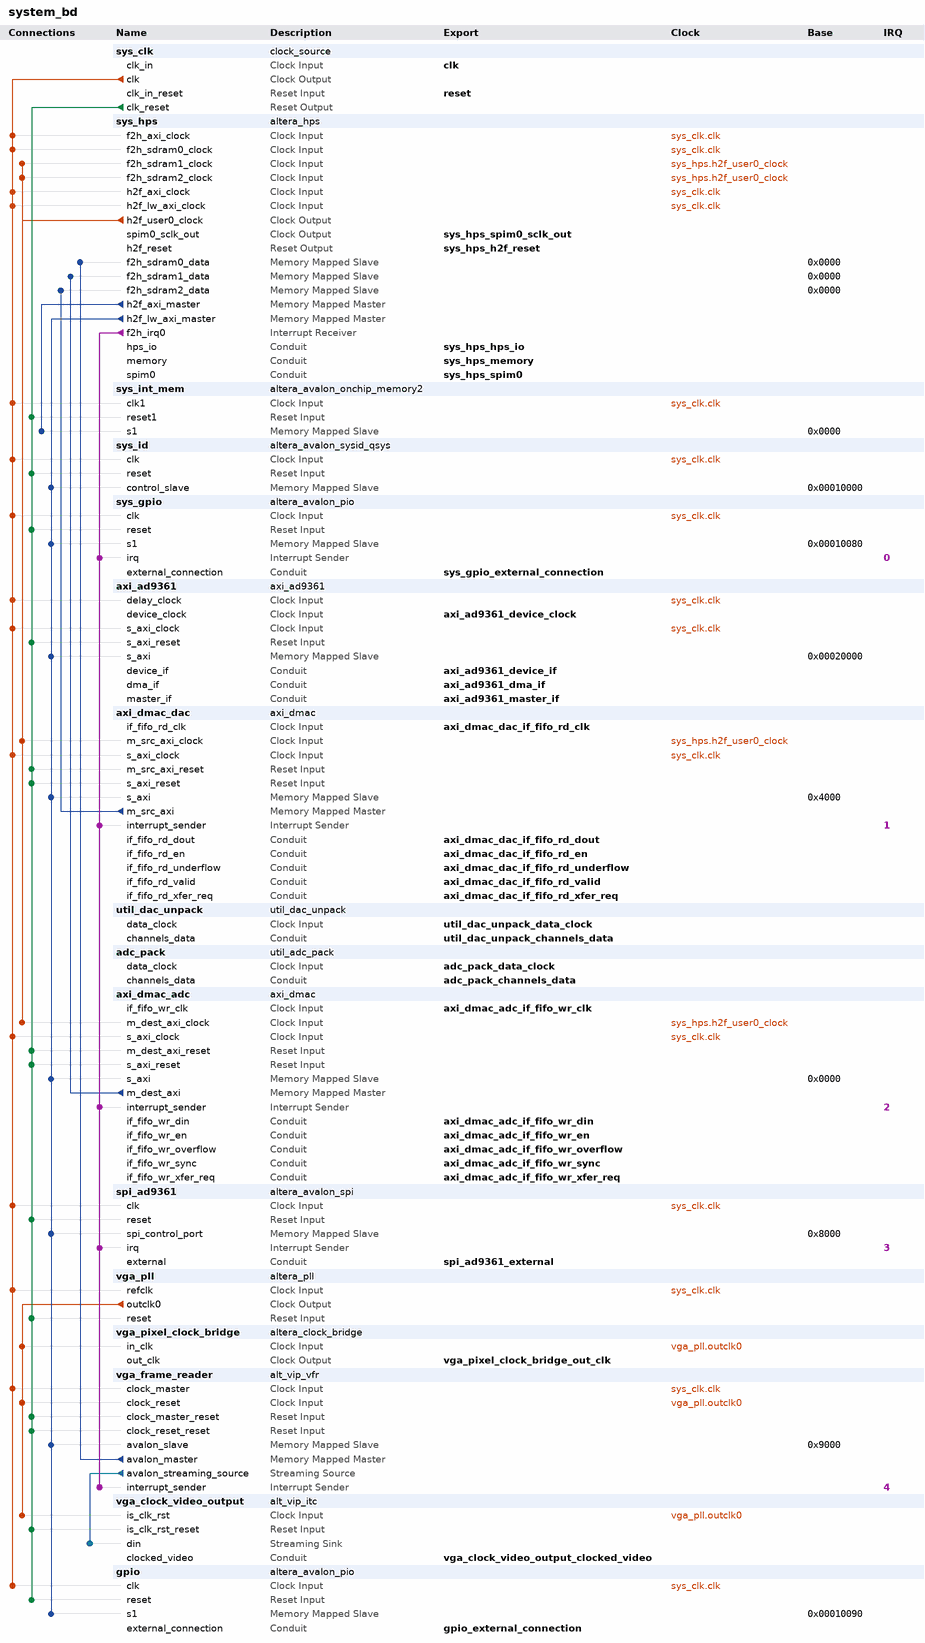
[diagram p0: system contents]
# Platform Designer (Qsys) system system_bd, Cyclone V 5CSXFC6D6F31C8ES
# Parameters at their usual value, and those the tool derives, are not listed.
package require -exact qsys 15.0
create_system system_bd
set_project_property DEVICE_FAMILY {Cyclone V}
set_project_property DEVICE 5CSXFC6D6F31C8ES

add_instance sys_clk clock_source 15.0
set_instance_parameter_value sys_clk clockFrequency 50000000

add_instance sys_hps altera_hps 15.0
set_instance_parameter_value sys_hps EMAC1_Mode RGMII
set_instance_parameter_value sys_hps EMAC1_PinMuxing {HPS I/O Set 0}
set_instance_parameter_value sys_hps F2SCLK_COLDRST_Enable false
set_instance_parameter_value sys_hps F2SCLK_DBGRST_Enable false
set_instance_parameter_value sys_hps F2SCLK_WARMRST_Enable false
set_instance_parameter_value sys_hps F2SDRAM_Type {Avalon-MM Bidirectional,AXI-3,AXI-3}
set_instance_parameter_value sys_hps F2SDRAM_Width 64,64,64
set_instance_parameter_value sys_hps F2SINTERRUPT_Enable true
set_instance_parameter_value sys_hps F2S_Width 2
set_instance_parameter_value sys_hps FPGA_PERIPHERAL_OUTPUT_CLOCK_FREQ_EMAC0_GTX_CLK 100
set_instance_parameter_value sys_hps FPGA_PERIPHERAL_OUTPUT_CLOCK_FREQ_EMAC0_MD_CLK 100.0
set_instance_parameter_value sys_hps FPGA_PERIPHERAL_OUTPUT_CLOCK_FREQ_EMAC1_GTX_CLK 100
set_instance_parameter_value sys_hps FPGA_PERIPHERAL_OUTPUT_CLOCK_FREQ_EMAC1_MD_CLK 100.0
set_instance_parameter_value sys_hps HPS_PROTOCOL DDR3
set_instance_parameter_value sys_hps I2C0_Mode N/A
set_instance_parameter_value sys_hps I2C0_PinMuxing Unused
set_instance_parameter_value sys_hps I2C1_Mode N/A
set_instance_parameter_value sys_hps I2C1_PinMuxing Unused
set_instance_parameter_value sys_hps LWH2F_Enable true
set_instance_parameter_value sys_hps MEM_BANKADDR_WIDTH 3
set_instance_parameter_value sys_hps MEM_CLK_FREQ 400.0
set_instance_parameter_value sys_hps MEM_COL_ADDR_WIDTH 10
set_instance_parameter_value sys_hps MEM_DQ_WIDTH 32
set_instance_parameter_value sys_hps MEM_DRV_STR RZQ/7
set_instance_parameter_value sys_hps MEM_ROW_ADDR_WIDTH 15
set_instance_parameter_value sys_hps MEM_RTT_NOM RZQ/4
set_instance_parameter_value sys_hps MEM_RTT_WR RZQ/4
set_instance_parameter_value sys_hps MEM_TCL 11
set_instance_parameter_value sys_hps MEM_TFAW_NS 30.0
set_instance_parameter_value sys_hps MEM_TRAS_NS 35.0
set_instance_parameter_value sys_hps MEM_TRCD_NS 13.75
set_instance_parameter_value sys_hps MEM_TRFC_NS 260.0
set_instance_parameter_value sys_hps MEM_TRP_NS 13.75
set_instance_parameter_value sys_hps MEM_VENDOR JEDEC
set_instance_parameter_value sys_hps MEM_WTCL 8
set_instance_parameter_value sys_hps QSPI_Mode {1 SS}
set_instance_parameter_value sys_hps QSPI_PinMuxing {HPS I/O Set 0}
set_instance_parameter_value sys_hps REF_CLK_FREQ 25.0
set_instance_parameter_value sys_hps S2FCLK_USER0CLK_Enable true
set_instance_parameter_value sys_hps S2F_Width 2
set_instance_parameter_value sys_hps SDIO_Mode {4-bit Data}
set_instance_parameter_value sys_hps SDIO_PinMuxing {HPS I/O Set 0}
set_instance_parameter_value sys_hps SPIM0_Mode Full
set_instance_parameter_value sys_hps SPIM0_PinMuxing FPGA
set_instance_parameter_value sys_hps SPIM1_Mode {Single Slave Select}
set_instance_parameter_value sys_hps SPIM1_PinMuxing {HPS I/O Set 0}
set_instance_parameter_value sys_hps STM_Enable false
set_instance_parameter_value sys_hps TIMING_BOARD_AC_SKEW 0.03
set_instance_parameter_value sys_hps TIMING_BOARD_AC_TO_CK_SKEW 0.0
set_instance_parameter_value sys_hps TIMING_BOARD_DQ_TO_DQS_SKEW 0.0
set_instance_parameter_value sys_hps TIMING_BOARD_MAX_CK_DELAY 0.03
set_instance_parameter_value sys_hps TIMING_BOARD_MAX_DQS_DELAY 0.02
set_instance_parameter_value sys_hps TIMING_BOARD_SKEW_BETWEEN_DQS 0.08
set_instance_parameter_value sys_hps TIMING_BOARD_SKEW_CKDQS_DIMM_MAX 0.16
set_instance_parameter_value sys_hps TIMING_BOARD_SKEW_CKDQS_DIMM_MIN 0.09
set_instance_parameter_value sys_hps TIMING_BOARD_SKEW_WITHIN_DQS 0.01
set_instance_parameter_value sys_hps TIMING_TDH 65
set_instance_parameter_value sys_hps TIMING_TDQSCK 255
set_instance_parameter_value sys_hps TIMING_TDQSQ 125
set_instance_parameter_value sys_hps TIMING_TDS 30
set_instance_parameter_value sys_hps TIMING_TIH 140
set_instance_parameter_value sys_hps TIMING_TIS 180
set_instance_parameter_value sys_hps TIMING_TQSH 0.4
set_instance_parameter_value sys_hps UART0_Mode {No Flow Control}
set_instance_parameter_value sys_hps UART0_PinMuxing {HPS I/O Set 0}
set_instance_parameter_value sys_hps USB1_Mode SDR
set_instance_parameter_value sys_hps USB1_PinMuxing {HPS I/O Set 0}
set_instance_parameter_value sys_hps desired_cfg_clk_mhz 80.0
set_instance_parameter_value sys_hps desired_qspi_clk_mhz 400.0

add_instance sys_int_mem altera_avalon_onchip_memory2 15.0
set_instance_parameter_value sys_int_mem dataWidth 64
set_instance_parameter_value sys_int_mem dualPort false
set_instance_parameter_value sys_int_mem initMemContent true
set_instance_parameter_value sys_int_mem initializationFileName onchip_memory2_0
set_instance_parameter_value sys_int_mem memorySize 65536

add_instance sys_id altera_avalon_sysid_qsys 15.0
set_instance_parameter_value sys_id id -1395322110

add_instance sys_gpio altera_avalon_pio 15.0
set_instance_parameter_value sys_gpio bitClearingEdgeCapReg true
set_instance_parameter_value sys_gpio captureEdge true
set_instance_parameter_value sys_gpio direction InOut
set_instance_parameter_value sys_gpio edgeType ANY
set_instance_parameter_value sys_gpio generateIRQ true
set_instance_parameter_value sys_gpio irqType EDGE
set_instance_parameter_value sys_gpio width 32

add_instance axi_ad9361 axi_ad9361 1.0
set_instance_parameter_value axi_ad9361 PCORE_DEVICE_TYPE 0
set_instance_parameter_value axi_ad9361 PCORE_ID 0

add_instance axi_dmac_dac axi_dmac 1.0
set_instance_parameter_value axi_dmac_dac C_2D_TRANSFER 0
set_instance_parameter_value axi_dmac_dac C_AXI_SLICE_DEST 1
set_instance_parameter_value axi_dmac_dac C_AXI_SLICE_SRC 0
set_instance_parameter_value axi_dmac_dac C_CLKS_ASYNC_DEST_REQ 1
set_instance_parameter_value axi_dmac_dac C_CLKS_ASYNC_REQ_SRC 1
set_instance_parameter_value axi_dmac_dac C_CLKS_ASYNC_SRC_DEST 1
set_instance_parameter_value axi_dmac_dac C_CYCLIC 1
set_instance_parameter_value axi_dmac_dac C_DMA_DATA_WIDTH_DEST 64
set_instance_parameter_value axi_dmac_dac C_DMA_DATA_WIDTH_SRC 64
set_instance_parameter_value axi_dmac_dac C_DMA_LENGTH_WIDTH 24
set_instance_parameter_value axi_dmac_dac C_DMA_TYPE_DEST 2
set_instance_parameter_value axi_dmac_dac C_DMA_TYPE_SRC 0
set_instance_parameter_value axi_dmac_dac C_FIFO_SIZE 4
set_instance_parameter_value axi_dmac_dac C_SYNC_TRANSFER_START 0
set_instance_parameter_value axi_dmac_dac PCORE_ID 0

add_instance util_dac_unpack util_dac_unpack 1.0
set_instance_parameter_value util_dac_unpack CHANNELS 4
set_instance_parameter_value util_dac_unpack DATA_WIDTH 16

add_instance adc_pack util_adc_pack 1.0
set_instance_parameter_value adc_pack CHANNELS 4
set_instance_parameter_value adc_pack DATA_WIDTH 16

add_instance axi_dmac_adc axi_dmac 1.0
set_instance_parameter_value axi_dmac_adc C_2D_TRANSFER 0
set_instance_parameter_value axi_dmac_adc C_AXI_SLICE_DEST 0
set_instance_parameter_value axi_dmac_adc C_AXI_SLICE_SRC 0
set_instance_parameter_value axi_dmac_adc C_CLKS_ASYNC_DEST_REQ 1
set_instance_parameter_value axi_dmac_adc C_CLKS_ASYNC_REQ_SRC 1
set_instance_parameter_value axi_dmac_adc C_CLKS_ASYNC_SRC_DEST 1
set_instance_parameter_value axi_dmac_adc C_CYCLIC 0
set_instance_parameter_value axi_dmac_adc C_DMA_DATA_WIDTH_DEST 64
set_instance_parameter_value axi_dmac_adc C_DMA_DATA_WIDTH_SRC 64
set_instance_parameter_value axi_dmac_adc C_DMA_LENGTH_WIDTH 24
set_instance_parameter_value axi_dmac_adc C_DMA_TYPE_DEST 0
set_instance_parameter_value axi_dmac_adc C_DMA_TYPE_SRC 2
set_instance_parameter_value axi_dmac_adc C_FIFO_SIZE 4
set_instance_parameter_value axi_dmac_adc C_SYNC_TRANSFER_START 1
set_instance_parameter_value axi_dmac_adc PCORE_ID 0

add_instance spi_ad9361 altera_avalon_spi 15.0
set_instance_parameter_value spi_ad9361 clockPolarity 1
set_instance_parameter_value spi_ad9361 dataWidth 8
set_instance_parameter_value spi_ad9361 masterSPI true
set_instance_parameter_value spi_ad9361 numberOfSlaves 1
set_instance_parameter_value spi_ad9361 targetClockRate 1000000

add_instance vga_pll altera_pll 15.0
set_instance_parameter_value vga_pll gui_device_speed_grade 2
set_instance_parameter_value vga_pll gui_number_of_clocks 2
set_instance_parameter_value vga_pll gui_operation_mode direct
set_instance_parameter_value vga_pll gui_output_clock_frequency0 85.5
set_instance_parameter_value vga_pll gui_output_clock_frequency1 171.0
set_instance_parameter_value vga_pll gui_pll_mode {Integer-N PLL}
set_instance_parameter_value vga_pll gui_reference_clock_frequency 50.0
set_instance_parameter_value vga_pll gui_use_locked false

add_instance vga_pixel_clock_bridge altera_clock_bridge 15.0
set_instance_parameter_value vga_pixel_clock_bridge DERIVED_CLOCK_RATE 85500000
set_instance_parameter_value vga_pixel_clock_bridge EXPLICIT_CLOCK_RATE 0

add_instance vga_frame_reader alt_vip_vfr 14.0
set_instance_parameter_value vga_frame_reader MAX_IMAGE_WIDTH 1360

add_instance vga_clock_video_output alt_vip_itc 14.0
set_instance_parameter_value vga_clock_video_output FIFO_DEPTH 1920
set_instance_parameter_value vga_clock_video_output H_ACTIVE_PIXELS 1360
set_instance_parameter_value vga_clock_video_output H_BACK_PORCH 256
set_instance_parameter_value vga_clock_video_output H_FRONT_PORCH 64
set_instance_parameter_value vga_clock_video_output H_SYNC_LENGTH 112
set_instance_parameter_value vga_clock_video_output NUMBER_OF_COLOUR_PLANES 4
set_instance_parameter_value vga_clock_video_output THRESHOLD 1919
set_instance_parameter_value vga_clock_video_output V_ACTIVE_LINES 768
set_instance_parameter_value vga_clock_video_output V_BACK_PORCH 18
set_instance_parameter_value vga_clock_video_output V_FRONT_PORCH 3
set_instance_parameter_value vga_clock_video_output V_SYNC_LENGTH 6

add_instance gpio altera_avalon_pio 15.0
set_instance_parameter_value gpio direction Output
set_instance_parameter_value gpio width 5

# connections
add_connection sys_clk.clk axi_ad9361.delay_clock clock
add_connection sys_clk.clk axi_ad9361.s_axi_clock clock
add_connection sys_clk.clk axi_dmac_adc.s_axi_clock clock
add_connection sys_clk.clk axi_dmac_dac.s_axi_clock clock
add_connection sys_clk.clk gpio.clk clock
add_connection sys_clk.clk spi_ad9361.clk clock
add_connection sys_clk.clk sys_gpio.clk clock
add_connection sys_clk.clk sys_hps.f2h_axi_clock clock
add_connection sys_clk.clk sys_hps.f2h_sdram0_clock clock
add_connection sys_clk.clk sys_hps.h2f_axi_clock clock
add_connection sys_clk.clk sys_hps.h2f_lw_axi_clock clock
add_connection sys_clk.clk sys_id.clk clock
add_connection sys_clk.clk sys_int_mem.clk1 clock
add_connection sys_clk.clk vga_frame_reader.clock_master clock
add_connection sys_clk.clk vga_pll.refclk clock
add_connection sys_hps.h2f_user0_clock axi_dmac_adc.m_dest_axi_clock clock
add_connection sys_hps.h2f_user0_clock axi_dmac_dac.m_src_axi_clock clock
add_connection sys_hps.h2f_user0_clock sys_hps.f2h_sdram1_clock clock
add_connection sys_hps.h2f_user0_clock sys_hps.f2h_sdram2_clock clock
add_connection vga_pll.outclk0 vga_clock_video_output.is_clk_rst clock
add_connection vga_pll.outclk0 vga_frame_reader.clock_reset clock
add_connection vga_pll.outclk0 vga_pixel_clock_bridge.in_clk clock
add_connection sys_clk.clk_reset axi_ad9361.s_axi_reset reset
add_connection sys_clk.clk_reset axi_dmac_adc.m_dest_axi_reset reset
add_connection sys_clk.clk_reset axi_dmac_adc.s_axi_reset reset
add_connection sys_clk.clk_reset axi_dmac_dac.m_src_axi_reset reset
add_connection sys_clk.clk_reset axi_dmac_dac.s_axi_reset reset
add_connection sys_clk.clk_reset gpio.reset reset
add_connection sys_clk.clk_reset spi_ad9361.reset reset
add_connection sys_clk.clk_reset sys_gpio.reset reset
add_connection sys_clk.clk_reset sys_id.reset reset
add_connection sys_clk.clk_reset sys_int_mem.reset1 reset
add_connection sys_clk.clk_reset vga_clock_video_output.is_clk_rst_reset reset
add_connection sys_clk.clk_reset vga_frame_reader.clock_master_reset reset
add_connection sys_clk.clk_reset vga_frame_reader.clock_reset_reset reset
add_connection sys_clk.clk_reset vga_pll.reset reset
add_connection axi_dmac_adc.m_dest_axi sys_hps.f2h_sdram1_data avalon
set_connection_parameter_value axi_dmac_adc.m_dest_axi/sys_hps.f2h_sdram1_data baseAddress 0x0000
add_connection axi_dmac_dac.m_src_axi sys_hps.f2h_sdram2_data avalon
set_connection_parameter_value axi_dmac_dac.m_src_axi/sys_hps.f2h_sdram2_data baseAddress 0x0000
add_connection sys_hps.h2f_axi_master sys_int_mem.s1 avalon
set_connection_parameter_value sys_hps.h2f_axi_master/sys_int_mem.s1 baseAddress 0x0000
add_connection sys_hps.h2f_lw_axi_master axi_ad9361.s_axi avalon
set_connection_parameter_value sys_hps.h2f_lw_axi_master/axi_ad9361.s_axi baseAddress 0x00020000
add_connection sys_hps.h2f_lw_axi_master axi_dmac_adc.s_axi avalon
set_connection_parameter_value sys_hps.h2f_lw_axi_master/axi_dmac_adc.s_axi baseAddress 0x0000
add_connection sys_hps.h2f_lw_axi_master axi_dmac_dac.s_axi avalon
set_connection_parameter_value sys_hps.h2f_lw_axi_master/axi_dmac_dac.s_axi baseAddress 0x4000
add_connection sys_hps.h2f_lw_axi_master gpio.s1 avalon
set_connection_parameter_value sys_hps.h2f_lw_axi_master/gpio.s1 baseAddress 0x00010090
add_connection sys_hps.h2f_lw_axi_master spi_ad9361.spi_control_port avalon
set_connection_parameter_value sys_hps.h2f_lw_axi_master/spi_ad9361.spi_control_port baseAddress 0x8000
add_connection sys_hps.h2f_lw_axi_master sys_gpio.s1 avalon
set_connection_parameter_value sys_hps.h2f_lw_axi_master/sys_gpio.s1 baseAddress 0x00010080
add_connection sys_hps.h2f_lw_axi_master sys_id.control_slave avalon
set_connection_parameter_value sys_hps.h2f_lw_axi_master/sys_id.control_slave baseAddress 0x00010000
add_connection sys_hps.h2f_lw_axi_master vga_frame_reader.avalon_slave avalon
set_connection_parameter_value sys_hps.h2f_lw_axi_master/vga_frame_reader.avalon_slave baseAddress 0x9000
add_connection vga_frame_reader.avalon_master sys_hps.f2h_sdram0_data avalon
set_connection_parameter_value vga_frame_reader.avalon_master/sys_hps.f2h_sdram0_data baseAddress 0x0000
add_connection vga_frame_reader.avalon_streaming_source vga_clock_video_output.din avalon_streaming
add_connection sys_hps.f2h_irq0 axi_dmac_adc.interrupt_sender interrupt
set_connection_parameter_value sys_hps.f2h_irq0/axi_dmac_adc.interrupt_sender irqNumber 2
add_connection sys_hps.f2h_irq0 axi_dmac_dac.interrupt_sender interrupt
set_connection_parameter_value sys_hps.f2h_irq0/axi_dmac_dac.interrupt_sender irqNumber 1
add_connection sys_hps.f2h_irq0 spi_ad9361.irq interrupt
set_connection_parameter_value sys_hps.f2h_irq0/spi_ad9361.irq irqNumber 3
add_connection sys_hps.f2h_irq0 sys_gpio.irq interrupt
set_connection_parameter_value sys_hps.f2h_irq0/sys_gpio.irq irqNumber 0
add_connection sys_hps.f2h_irq0 vga_frame_reader.interrupt_sender interrupt
set_connection_parameter_value sys_hps.f2h_irq0/vga_frame_reader.interrupt_sender irqNumber 4

# exported interfaces
add_interface adc_pack_channels_data conduit end
set_interface_property adc_pack_channels_data EXPORT_OF adc_pack.channels_data
add_interface adc_pack_data_clock clock sink
set_interface_property adc_pack_data_clock EXPORT_OF adc_pack.data_clock
add_interface axi_ad9361_device_clock clock sink
set_interface_property axi_ad9361_device_clock EXPORT_OF axi_ad9361.device_clock
add_interface axi_ad9361_device_if conduit end
set_interface_property axi_ad9361_device_if EXPORT_OF axi_ad9361.device_if
add_interface axi_ad9361_dma_if conduit end
set_interface_property axi_ad9361_dma_if EXPORT_OF axi_ad9361.dma_if
add_interface axi_ad9361_master_if conduit end
set_interface_property axi_ad9361_master_if EXPORT_OF axi_ad9361.master_if
add_interface axi_dmac_adc_if_fifo_wr_clk clock sink
set_interface_property axi_dmac_adc_if_fifo_wr_clk EXPORT_OF axi_dmac_adc.if_fifo_wr_clk
add_interface axi_dmac_adc_if_fifo_wr_din conduit end
set_interface_property axi_dmac_adc_if_fifo_wr_din EXPORT_OF axi_dmac_adc.if_fifo_wr_din
add_interface axi_dmac_adc_if_fifo_wr_en conduit end
set_interface_property axi_dmac_adc_if_fifo_wr_en EXPORT_OF axi_dmac_adc.if_fifo_wr_en
add_interface axi_dmac_adc_if_fifo_wr_overflow conduit end
set_interface_property axi_dmac_adc_if_fifo_wr_overflow EXPORT_OF axi_dmac_adc.if_fifo_wr_overflow
add_interface axi_dmac_adc_if_fifo_wr_sync conduit end
set_interface_property axi_dmac_adc_if_fifo_wr_sync EXPORT_OF axi_dmac_adc.if_fifo_wr_sync
add_interface axi_dmac_adc_if_fifo_wr_xfer_req conduit end
set_interface_property axi_dmac_adc_if_fifo_wr_xfer_req EXPORT_OF axi_dmac_adc.if_fifo_wr_xfer_req
add_interface axi_dmac_dac_if_fifo_rd_clk clock sink
set_interface_property axi_dmac_dac_if_fifo_rd_clk EXPORT_OF axi_dmac_dac.if_fifo_rd_clk
add_interface axi_dmac_dac_if_fifo_rd_dout conduit end
set_interface_property axi_dmac_dac_if_fifo_rd_dout EXPORT_OF axi_dmac_dac.if_fifo_rd_dout
add_interface axi_dmac_dac_if_fifo_rd_en conduit end
set_interface_property axi_dmac_dac_if_fifo_rd_en EXPORT_OF axi_dmac_dac.if_fifo_rd_en
add_interface axi_dmac_dac_if_fifo_rd_underflow conduit end
set_interface_property axi_dmac_dac_if_fifo_rd_underflow EXPORT_OF axi_dmac_dac.if_fifo_rd_underflow
add_interface axi_dmac_dac_if_fifo_rd_valid conduit end
set_interface_property axi_dmac_dac_if_fifo_rd_valid EXPORT_OF axi_dmac_dac.if_fifo_rd_valid
add_interface axi_dmac_dac_if_fifo_rd_xfer_req conduit end
set_interface_property axi_dmac_dac_if_fifo_rd_xfer_req EXPORT_OF axi_dmac_dac.if_fifo_rd_xfer_req
add_interface clk clock sink
set_interface_property clk EXPORT_OF sys_clk.clk_in
add_interface gpio_external_connection conduit end
set_interface_property gpio_external_connection EXPORT_OF gpio.external_connection
add_interface reset reset sink
set_interface_property reset EXPORT_OF sys_clk.clk_in_reset
add_interface spi_ad9361_external conduit end
set_interface_property spi_ad9361_external EXPORT_OF spi_ad9361.external
add_interface sys_gpio_external_connection conduit end
set_interface_property sys_gpio_external_connection EXPORT_OF sys_gpio.external_connection
add_interface sys_hps_h2f_reset reset source
set_interface_property sys_hps_h2f_reset EXPORT_OF sys_hps.h2f_reset
add_interface sys_hps_hps_io conduit end
set_interface_property sys_hps_hps_io EXPORT_OF sys_hps.hps_io
add_interface sys_hps_memory conduit end
set_interface_property sys_hps_memory EXPORT_OF sys_hps.memory
add_interface sys_hps_spim0 conduit end
set_interface_property sys_hps_spim0 EXPORT_OF sys_hps.spim0
add_interface sys_hps_spim0_sclk_out clock source
set_interface_property sys_hps_spim0_sclk_out EXPORT_OF sys_hps.spim0_sclk_out
add_interface util_dac_unpack_channels_data conduit end
set_interface_property util_dac_unpack_channels_data EXPORT_OF util_dac_unpack.channels_data
add_interface util_dac_unpack_data_clock clock sink
set_interface_property util_dac_unpack_data_clock EXPORT_OF util_dac_unpack.data_clock
add_interface vga_clock_video_output_clocked_video conduit end
set_interface_property vga_clock_video_output_clocked_video EXPORT_OF vga_clock_video_output.clocked_video
add_interface vga_pixel_clock_bridge_out_clk clock source
set_interface_property vga_pixel_clock_bridge_out_clk EXPORT_OF vga_pixel_clock_bridge.out_clk

set_interconnect_requirement {$system} qsys_mm.clockCrossingAdapter FIFO
set_interconnect_requirement {$system} qsys_mm.maxAdditionalLatency 2
set_interconnect_requirement {mm_interconnect_0|cmd_mux} qsys_mm.postTransform.pipelineCount 0
set_interconnect_requirement {mm_interconnect_2|cmd_mux} qsys_mm.postTransform.pipelineCount 0
set_interconnect_requirement {mm_interconnect_3|cmd_mux} qsys_mm.postTransform.pipelineCount 0
set_interconnect_requirement {mm_interconnect_3|cmd_mux_001} qsys_mm.postTransform.pipelineCount 0
set_interconnect_requirement {mm_interconnect_4|axi_dmac_dac_m_src_axi_agent.write_cp/router.sink} qsys_mm.postTransform.pipelineCount 0
set_interconnect_requirement {mm_interconnect_4|cmd_mux} qsys_mm.postTransform.pipelineCount 0
set_interconnect_requirement {mm_interconnect_4|cmd_mux_001} qsys_mm.postTransform.pipelineCount 0

save_system system_bd.qsys
